# EAGLE design PCB PUMP LED (EAGLE 9.5.1)
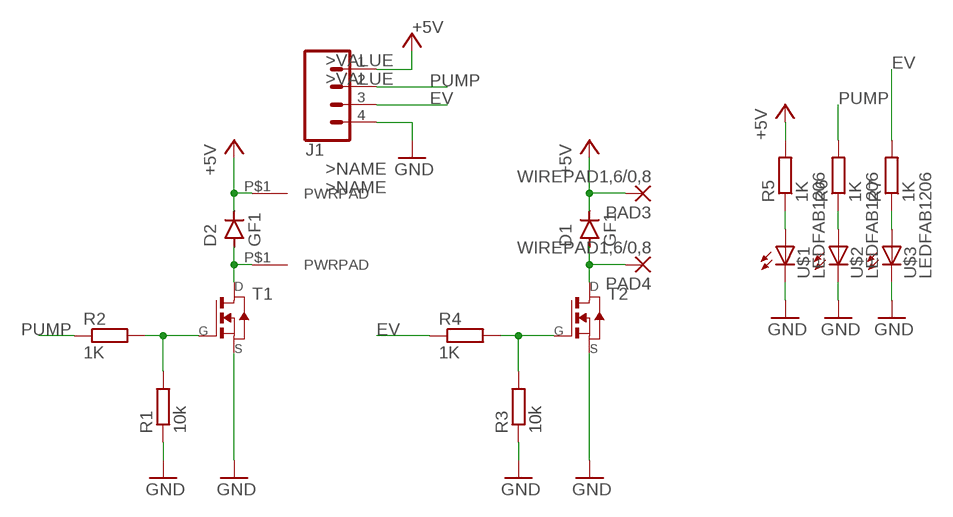
[diagram p0: schematic, sheet 1]

## Parts
D1  GF1  [SMA-DO214AC]
D2  GF1  [SMA-DO214AC]
J1  CONN_04POLAR  [MOLEX-1X4]
J3  PWRPAD2-5MM  [PWRPAD_2-5MM]
J4  PWRPAD2-5MM  [PWRPAD_2-5MM]
PAD3  WIREPAD1,6/0,8  [1,6/0,8]
PAD4  WIREPAD1,6/0,8  [1,6/0,8]
R1  10k  R-EU_R1206  [R1206]
R2  1K  R-EU_R1206  [R1206]
R3  10k  R-EU_R1206  [R1206]
R4  1K  R-EU_R1206  [R1206]
R5  1K  R-EU_R1206  [R1206]
R6  1K  R-EU_R1206  [R1206]
R7  1K  R-EU_R1206  [R1206]
T1  NMOSFETSOT23  [SOT-23]
T2  NMOSFETSOT23  [SOT-23]
U$1  LEDFAB1206  [LED1206FAB]
U$2  LEDFAB1206  [LED1206FAB]
U$3  LEDFAB1206  [LED1206FAB]

## Nets
+5V: D1.K(C) D2.K(C) J1.1 J4.P$1(PWRPAD) PAD3.1(P) R5.2
EV: J1.3 R4.1 R7.2
GND: J1.4 R1.1 R3.1 T1.2(S) T2.2(S) U$1.2(C) U$2.2(C) U$3.2(C)
N$1: D1.A PAD4.1(P) T2.1(D)
N$2: D2.A J3.P$1(PWRPAD) T1.1(D)
N$3: R1.2 R2.2 T1.3(G)
N$4: R3.2 R4.2 T2.3(G)
N$5: R5.1 U$1.1(A)
N$6: R6.1 U$2.1(A)
N$7: R7.1 U$3.1(A)
PUMP: J1.2 R2.1 R6.2

## Library data of the parts
D1 D2 = diode:GF1: DIODE
J1 = OPENBOT:CONN_04: Multi connection point. Often used as Generic Header-pin footprint for 0.1 inch spaced/style header connections On any of the 0.1 inch spaced packages, you can populate with these: Break Away Headers - Straight <https://www.sparkfun.com/products/116> (PRT-00116) Break Away Male Headers - Right Angle <https://www.sparkfun.com/products/553> (PRT-00553) Female Headers <https://www.sparkfun.com/products/115> (PRT-00115) Break Away Headers - Machine Pin <https://www.sparkfun.com/products/117> (PRT-00117) Break Away Female Headers - Swiss Machine Pin <https://www.sparkfun.com/products/743> (PRT-00743) For SCREWTERMINALS and SPRING TERMINALS visit here: Screw Terimnals on SparkFun.com <https://www.sparkfun.com/search/results?term=Screw+Terminals> (5mm/3.5mm/2.54mm spacing) This device is also useful as a general connection point to wire up your design to another part of your project. Our various solder wires solder well into these plated through hole pads. Hook-Up Wire - Assortment (Stranded, 22 AWG) <https://www.sparkfun.com/products/11375> (PRT-11375) Hook-Up Wire - Assortment (Solid Core, 22 AWG) <https://www.sparkfun.com/products/11367> (PRT-11367) View the entire wire category on our website here <https://www.sparkfun.com/categories/141> Special notes: Molex polarized connector foot print use with SKU : PRT-08231 with associated crimp pins and housings. 1MM SMD Version SKU: PRT-10208 Multi connection point. Often used as Generic Header-pin footprint for 0.1 inch spaced/style header connections On any of the 0.1 inch spaced packages, you can populate with these: Break Away Headers - Straight <https://www.sparkfun.com/products/116> (PRT-00116) Break Away Male Headers - Right Angle <https://www.sparkfun.com/products/553> (PRT-00553) Female Headers <https://www.sparkfun.com/products/115> (PRT-00115) Break Away Headers - Machine Pin <https://www.sparkfun.com/products/117> (PRT-00117) Break Away Female Headers - Swiss Machine Pin <https://www.sparkfun.com/products/743> (PRT-00743) For SCREWTERMINALS and SPRING TERMINALS visit here: Screw Terimnals on SparkFun.com <https://www.sparkfun.com/search/results?term=Screw+Terminals> (5mm/3.5mm/2.54mm spacing) This device is also useful as a general connection point to wire up your design to another part of your project. Our various solder wires solder well into these plated through hole pads. Hook-Up Wire - Assortment (Stranded, 22 AWG) <https://www.sparkfun.com/products/11375> (PRT-11375) Hook-Up Wire - Assortment (Solid Core, 22 AWG) <https://www.sparkfun.com/products/11367> (PRT-11367) View the entire wire category on our website here <https://www.sparkfun.com/categories/141> Special notes: Molex polarized connector foot print use with SKU : PRT-08231 with associated crimp pins and housings. 1MM SMD Version SKU: PRT-10208; PROD_ID: CONN-08186; SF_ID: PRT-08231
J3 J4 = fab:PWRPAD
PAD3 PAD4 = wirepad:WIREPAD: Wire PAD connect wire on PCB
R1-R7 = rcl:R-EU_: RESISTOR, European symbol; SPICEPREFIX: R
T1 T2 = fab:NMOSFET: MOS FET
U$1-U$3 = fab:LED: LED

## Board
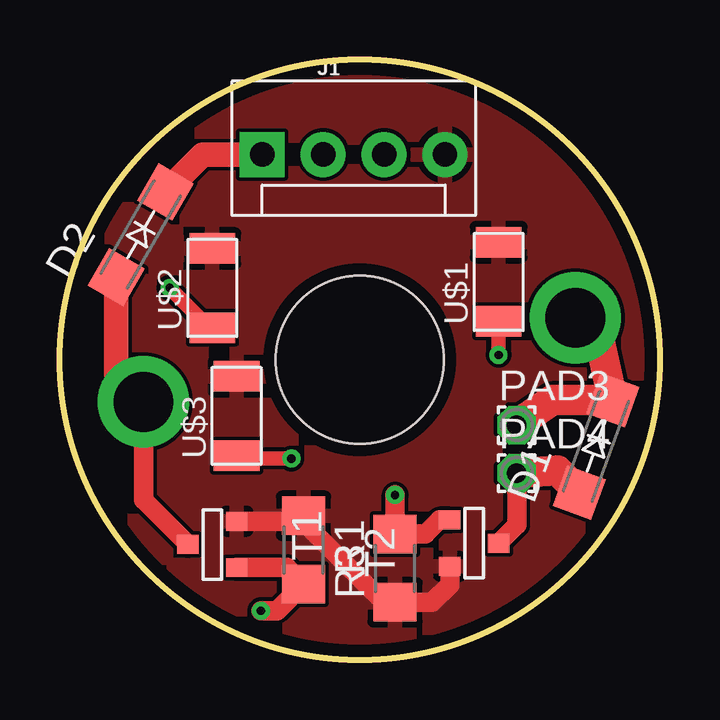
[diagram p1: board, top side]
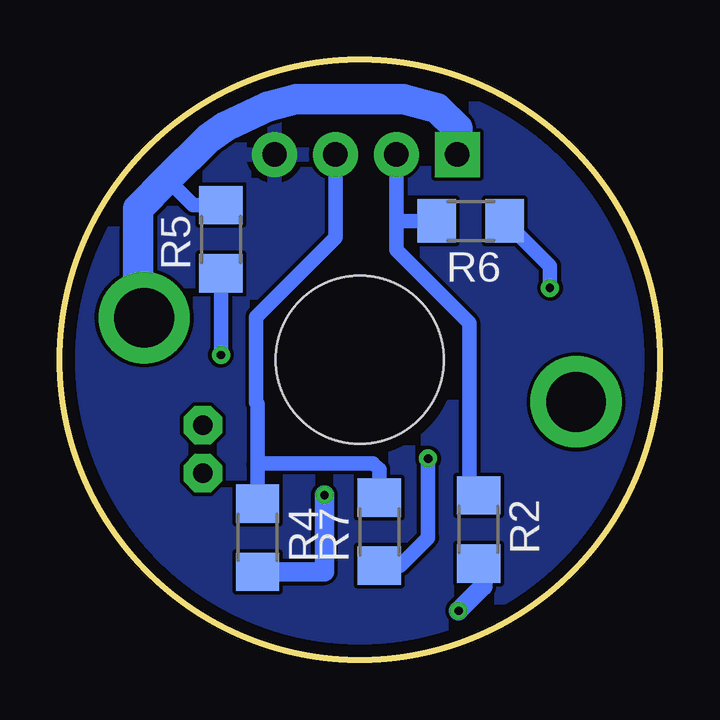
[diagram p2: board, bottom side, seen from below]

Size 25 x 25 mm. Coordinates in mm from the lower left corner, seen from the top.
Outline: circle at 12.5,12.5 radius 12.5
Copper layers (1*16): Top 0.035mm / dielectric 1.5mm / Bottom 0.035mm
Design rules "default *": minimum track width 6mil, minimum drill 0.35mm, track to track 6mil, track to pad 6mil, pad to pad 6mil, via to via 6mil, smd to smd 6mil, copper to edge 20mil, drill to drill 6mil, minimum pad ring 10mil, minimum via ring 8mil, stop-mask expansion 4mil, vias tented up to drill 0mil, thermal gap 10mil
Holes 7 mm at 12.5,12.5

### Footprints (pad centres in the part's own frame; a part is rotated, then mirrored left to right if it is on the bottom)
SMA-DO214AC = smd 1.8 x 1.7: A -2.05,0; K 2.05,0
MOLEX-1X4 = drill 1.016 pad 1.88 square: 1 0,0 | drill 1.016 pad 1.88: 2 2.54,0; 3 5.08,0; 4 7.62,0
PWRPAD_2-5MM = drill 2.489 pad 3.81: P$1 0,0
1,6/0,8 = drill 0.813 pad 1.6 octagon: 1 0,0
R1206 = smd 1.6 x 1.803: 1 -1.422,0; 2 1.422,0
SOT-23 = smd 0.787 x 0.889: 1 0.025,-1.016; 2 -0.94,1.016; 3 0.991,1.016
LED1206FAB = smd 1.27 x 1.905: 1 -1.651,0; 2 1.651,0

### Placement (x,y rotation side)
D1  22.35,8.89 70 top
D2  3.37,17.72 60 top
J1  8.43,21.06 0 top
J3  3.48,10.74 0 top
J4  21.49,14.25 0 top
PAD3  19.05,9.78 0 top
PAD4  19.05,7.77 0 top
R1  10.16,4.57 270 top
R2  7.55,5.42 270 bottom
R3  13.97,3.81 90 top
R4  16.76,5.08 270 bottom
R5  18.29,17.53 90 bottom
R6  7.87,18.29 180 bottom
R7  11.68,5.33 90 bottom
T1  6.35,4.83 270 top
T2  17.27,4.83 90 top
U$1  18.29,15.75 90 top
U$2  6.35,15.49 90 top
U$3  7.37,10.16 90 top

### Tracks (layer width: path | path; a pad name or v marks a point on that pad's centre or on a via)
+5V
  Top 1.016: D2.K 5.96,21.06 8.18,21.06
  Top 1.27: J1.1 8.18,21.06 8.16,21.04 | J4.P$1 21.58,14.34 21.74,14.34 22.42,13.66 D1.K 20.53,10.82 19.04,9.79 PAD3.1
  Bottom 0.61: R5.2 19.46,18.95 20.53,20.02
  Bottom 1.27: J1.1 8.43,22.15 9.28,23 10.67,23.37 15.16,23.37 16.34,23.05 18.11,22.23 18.82,21.73 20.53,20.02 21.74,18.81 21.74,14.5 J4.P$1
EV
  Bottom 0.61: J1.3 13.51,17.59 16.81,14.29 16.81,10.71 16.76,10.66 16.76,8.13 | 16.76,8.13 R4.1 | R7.2 11.68,7.93 11.94,8.19 16.7,8.19 16.76,8.13
GND
  Top 0.813: T2.2 16.26,3.12 15.52,2.39 R3.1 13.51,2.39 10.16,5.74 R1.1 9.93,5.77 T1.2
  pour Top: -0.76,25.91 25.65,25.91 25.65,-0.76 -0.76,-0.76
  pour Bottom: -1.78,25.65 25.65,25.65 25.65,-1.02 -1.78,-1.02
N$1
  Top 0.813: T2.1 19.05,5.61 PAD4.1
  Top 1.27: D1.A 20.74,7.88 PAD4.1
N$2
  Top 0.813: T1.1 3.48,6.66 J3.P$1
  Top 1.016: D2.A 2.35,11.88 J3.P$1
N$3  (via drill 0.35)
  Top 0.813: T1.3 9.47,3.83 R1.2 9.04,2.03 v8.38,2.03
  Bottom 0.813: R2.2 7.37,3.82 7.37,3.05 v8.38,2.03
N$4  (via drill 0.35)
  Top 0.813: T2.3 15.82,5.82 15.24,5.23 R3.2 v13.97,6.86
  Bottom 0.813: R4.2 13.97,3.66 v13.97,6.86
N$5  (via drill 0.35)
  Top 0.61: U$1.1 v18.29,12.7
  Bottom 0.61: R5.1 v18.29,12.7
N$6  (via drill 0.35)
  Top 0.61: v4.57,15.49 6.22,13.84 U$2.1
  Bottom 0.61: R6.1 4.57,16.41 v4.57,15.49
N$7  (via drill 0.35)
  Top 0.61: v9.65,8.38 7.49,8.38 U$3.1
  Bottom 0.61: R7.1 10.82,3.91 9.65,5.08 v9.65,8.38
PUMP
  Bottom 0.61: J1.2 10.97,18.29 | 10.97,18.29 10.97,17.07 7.93,14.03 7.93,7.23 R2.1 | R6.2 10.97,18.29